# Altium schematic sheet 08_SD_card.SchDoc
size OrCAD B
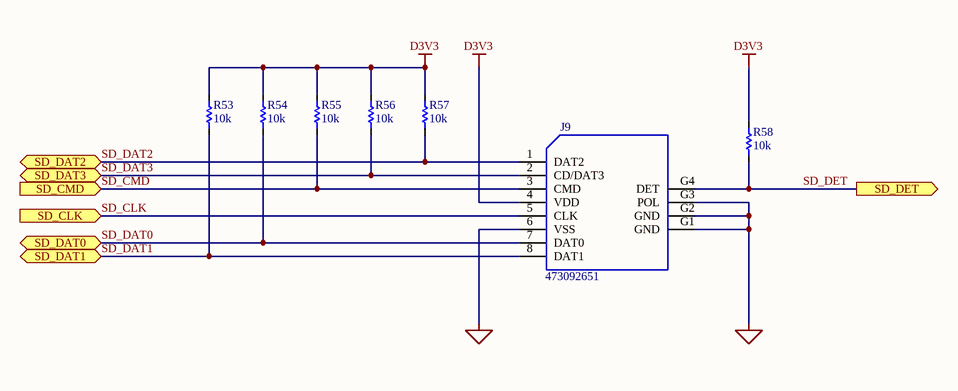
[diagram p0: 08_SD_card.SchDoc]

## Parts
J9  473092651  [473092651]
R53  10k  [R0402]
R54  10k  [R0402]
R55  10k  [R0402]
R56  10k  [R0402]
R57  10k  [R0402]
R58  10k  [R0402]

## Ports
SD_CLK (in), SD_CMD (in), SD_DAT0 (bidir), SD_DAT1 (bidir), SD_DAT2 (bidir), SD_DAT3 (bidir), SD_DET (out)

## Nets
D3V3: J9.4(VDD) R53.2 R54.2 R55.2 R56.2 R57.2 R58.2
GND: J9.6(VSS) J9.G1(GND) J9.G2(GND) J9.G3(POL)
SD_CLK: J9.5(CLK) ; port SD_CLK
SD_CMD: J9.3(CMD) R55.1 ; port SD_CMD
SD_DAT0: J9.7(DAT0) R54.1 ; port SD_DAT0
SD_DAT1: J9.8(DAT1) R53.1 ; port SD_DAT1
SD_DAT2: J9.1(DAT2) R57.1 ; port SD_DAT2
SD_DAT3: J9.2(CD/DAT3) R56.1 ; port SD_DAT3
SD_DET: J9.G4(DET) R58.1 ; port SD_DET

## Library data of the parts
J9 = 473092651: micro SD card header, detect pin, SMD; Manufacturer1: Molex; Manufacturer2: *; PartNumberManufacturer1: 473092651; PartNumberManufacturer2: *; UnitPrice: *
R53-R58 = RES012: RES,10k,1%,1/16W,0402; Manufacturer1: *; PartNumberManufacturer2: *; Manufacturer2: *; PartNumberManufacturer1: *; Value: 10k; UnitPrice: *